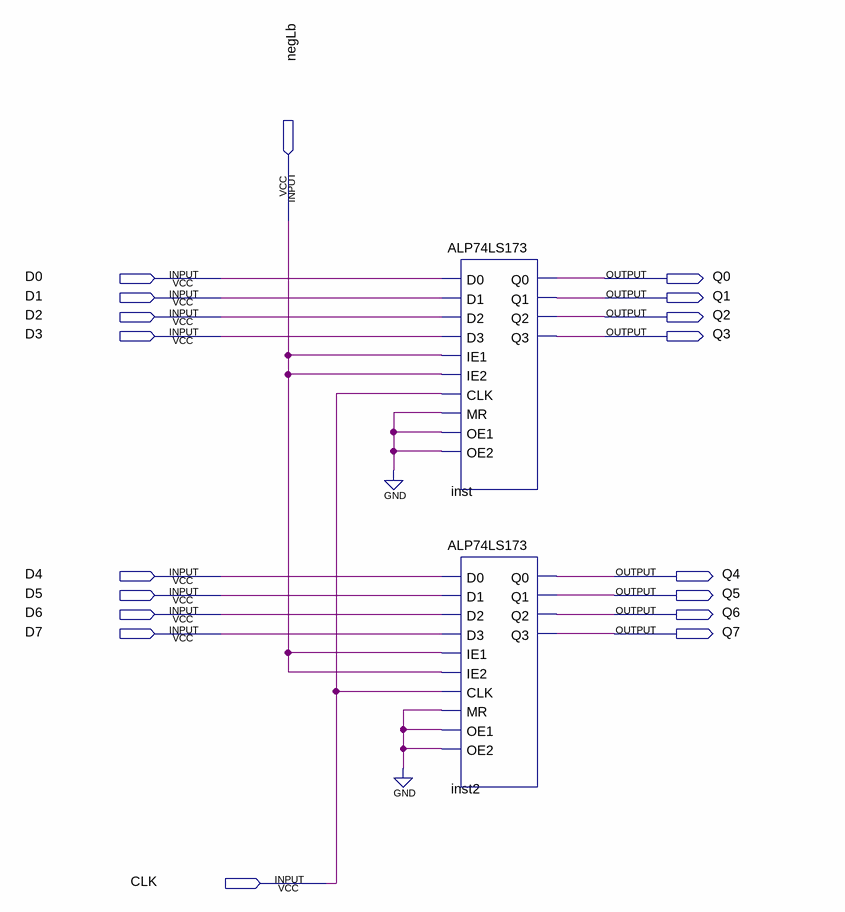
[diagram p0: schematic sheet]
// Quartus schematic RegistradorB.bdf as structural Verilog: 2 symbols, 18 pins
module RegistradorB (
  input  negLb,
  input  D0,
  input  D1,
  input  D2,
  input  D3,
  input  D4,
  input  D5,
  input  D6,
  input  D7,
  input  CLK,
  output Q0,
  output Q1,
  output Q2,
  output Q3,
  output Q4,
  output Q5,
  output Q6,
  output Q7
);

  ALP74LS173 inst (
    .D0(D0), .D1(D1), .D2(D2), .D3(D3), .IE1(negLb), .IE2(negLb), .MR(1'b0), .OE1(1'b0), .OE2(1'b0),
    .CP(CLK), .Q0(Q0), .Q1(Q1), .Q2(Q2), .Q3(Q3));
  ALP74LS173 inst2 (
    .D0(D4), .D1(D5), .D2(D6), .D3(D7), .IE1(negLb), .IE2(negLb), .MR(1'b0), .OE1(1'b0), .OE2(1'b0),
    .CP(CLK), .Q0(Q4), .Q1(Q5), .Q2(Q6), .Q3(Q7));
endmodule
